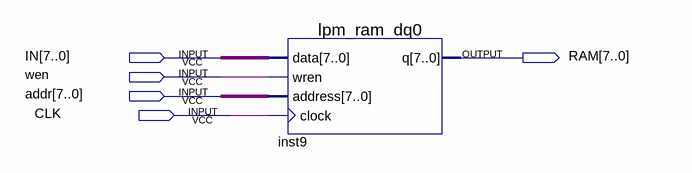
[diagram p0: schematic sheet]
// Quartus schematic ram_a.bdf as structural Verilog: 1 symbols, 5 pins
module ram_a (
  input  [7:0] IN,
  input  wen,
  input  [7:0] addr,
  input  CLK,
  output [7:0] RAM
);

  lpm_ram_dq0 inst9 (.data(IN), .wren(wen), .address(addr), .clock(CLK), .q(RAM));
endmodule
